# Altium schematic sheet OK6010_DB.SchDoc
size 260 x 195 mm; PageSetup: Record=PageOptions|CenterHorizontal=True|CenterVertical=True|PrintScale=1.06|XCorrection=1.00|YCorrection=1.00|PrintKind=2|BorderSize=5000000|LeftOffset=0|BottomOffset=0|Orientation=2|PaperLength=1000|PaperWidth=1000|Scale=100|PaperSource=15|PrintQuality=600|MediaType=1|DitherType=10|PaperKind=Letter|PrintScaleMode=1
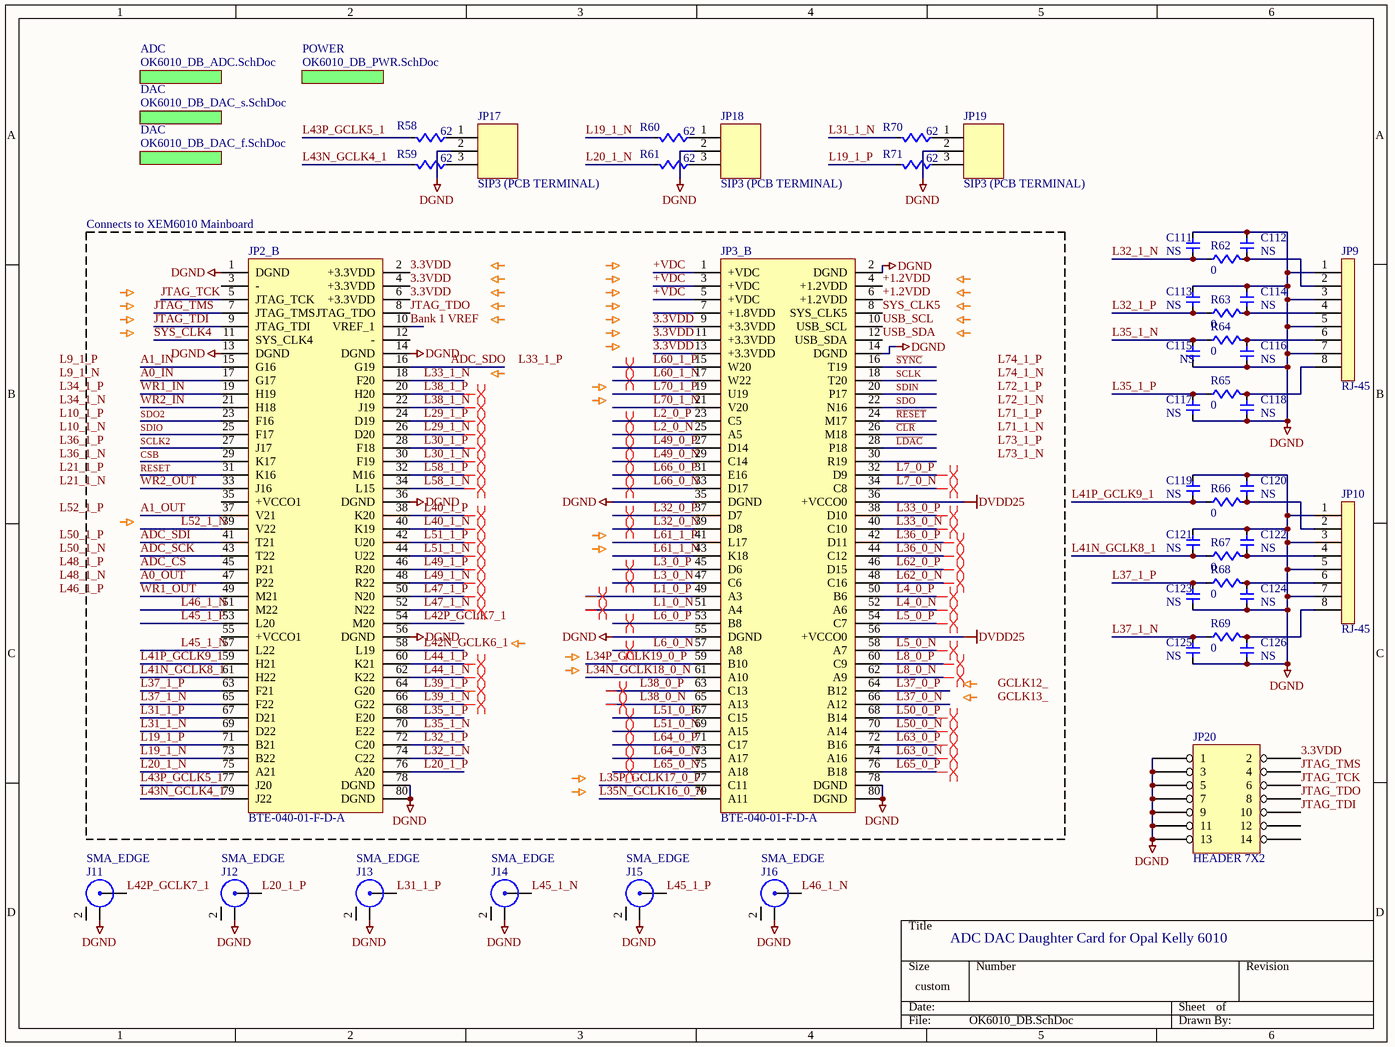
[diagram p0: OK6010_DB.SchDoc]

## Parts
C111  NS  [0603w]
C112  NS  [0603w]
C113  NS  [0603w]
C114  NS  [0603w]
C115  NS  [0603w]
C116  NS  [0603w]
C117  NS  [0603w]
C118  NS  [0603w]
C119  NS  [0603w]
C120  NS  [0603w]
C121  NS  [0603w]
C122  NS  [0603w]
C123  NS  [0603w]
C124  NS  [0603w]
C125  NS  [0603w]
C126  NS  [0603w]
J11  SMA_EDGE  [sma_edge]
J12  SMA_EDGE  [sma_edge]
J13  SMA_EDGE  [sma_edge]
J14  SMA_EDGE  [sma_edge]
J15  SMA_EDGE  [sma_edge]
J16  SMA_EDGE  [sma_edge]
JP2_B  BTE-040-01-F-D-A  [BTE-040-01-F-D-A]
JP3_B  BTE-040-01-F-D-A  [BTE-040-01-F-D-A]
JP9  RJ-45  [SMD_ETHERNET]
JP10  RJ-45  [SMD_ETHERNET]
JP17  SIP3 (PCB TERMINAL)  [SIP3MOLEX]
JP18  SIP3 (PCB TERMINAL)  [SIP3MOLEX]
JP19  SIP3 (PCB TERMINAL)  [SIP3MOLEX]
JP20  HEADER 7X2  [IDC14 SM 2MM]
R58  62  [0603w]
R59  62  [0603w]
R60  62  [0603w]
R61  62  [0603w]
R62  0  [0603w]
R63  0  [0603w]
R64  0  [0603w]
R65  0  [0603w]
R66  0  [0603w]
R67  0  [0603w]
R68  0  [0603w]
R69  0  [0603w]
R70  62  [0603w]
R71  62  [0603w]

## Blocks framed on the sheet
Connects to XEM6010 Mainboard: JP2_B JP3_B

## Sub-sheets
ADC = OK6010_DB_ADC.SchDoc: no entries
DAC = OK6010_DB_DAC_s.SchDoc: no entries
DAC = OK6010_DB_DAC_f.SchDoc: no entries
POWER = OK6010_DB_PWR.SchDoc: no entries

## Nets
DGND: C111.1 C112.1 C113.1 C114.1 C115.2 C116.2 C117.2 C118.2 C119.1 C120.1 C121.1 C122.1 C123.2 C124.2 C125.2 C126.2 J11.2(ground) J12.2(ground) J13.2(ground) J14.2(ground) J15.2(ground) J16.2(ground) JP2_B.1(DGND) JP2_B.13(DGND) JP2_B.14(DGND) JP2_B.36(DGND) JP2_B.56(DGND) JP2_B.78(DGND) JP2_B.80(DGND) JP3_B.2(DGND) JP3_B.14(DGND) JP3_B.35(DGND) JP3_B.55(DGND) JP3_B.78(DGND) JP3_B.80(DGND) JP9.1 JP9.3 JP9.5 JP9.7 JP10.1 JP10.3 JP10.5 JP10.7 JP17.2 JP18.2 JP19.2 JP20.1 JP20.3 JP20.5 JP20.7 JP20.9 JP20.11 JP20.13
DVDD25: JP3_B.36(+VCCO0) JP3_B.56(+VCCO0)
3.3VDD: JP2_B.2(+3.3VDD) JP2_B.4(+3.3VDD) JP2_B.6(+3.3VDD) JP3_B.9(+3.3VDD) JP3_B.11(+3.3VDD) JP3_B.13(+3.3VDD) JP20.2
+1.2VDD: JP3_B.4(+1.2VDD) JP3_B.6(+1.2VDD)
+VDC: JP3_B.1(+VDC) JP3_B.3(+VDC) JP3_B.5(+VDC)
A0_IN: JP2_B.17(G17)
A0_OUT: JP2_B.47(P22)
A1_IN: JP2_B.15(G16)
A1_OUT: JP2_B.37(V21)
ADC_CS: JP2_B.45(P21)
ADC_SCK: JP2_B.43(T22)
ADC_SDI: JP2_B.41(T21)
ADC_SDO: JP2_B.16(G19)
Bank 1 VREF: JP2_B.10(VREF_1)
~{CLR}: JP3_B.26(M18)
CSB: JP2_B.29(K17)
JTAG_TCK: JP2_B.5(JTAG_TCK) JP20.6
JTAG_TDI: JP2_B.9(JTAG_TDI) JP20.10
JTAG_TDO: JP2_B.8(JTAG_TDO) JP20.8
JTAG_TMS: JP2_B.7(JTAG_TMS) JP20.4
L1_0_N: JP3_B.51(A4)
L1_0_P: JP3_B.49(A3)
L2_0_N: JP3_B.25(A5)
L2_0_P: JP3_B.23(C5)
L3_0_N: JP3_B.47(C6)
L3_0_P: JP3_B.45(D6)
L4_0_N: JP3_B.52(A6)
L4_0_P: JP3_B.50(B6)
L5_0_N: JP3_B.58(A7)
L5_0_P: JP3_B.54(C7)
L6_0_N: JP3_B.57(A8)
L6_0_P: JP3_B.53(B8)
L7_0_N: JP3_B.34(C8)
L7_0_P: JP3_B.32(D9)
L8_0_N: JP3_B.62(A9)
L8_0_P: JP3_B.60(C9)
L19_1_N: JP2_B.73(B22) R60.2
L19_1_P: JP2_B.71(B21) R71.2
L20_1_N: JP2_B.75(A21) R61.2
L20_1_P: J12.1(signal) JP2_B.76(A20)
L29_1_N: JP2_B.26(D20)
L29_1_P: JP2_B.24(D19)
L30_1_N: JP2_B.30(F19)
L30_1_P: JP2_B.28(F18)
L31_1_N: JP2_B.69(D22) R70.2
L31_1_P: J13.1(signal) JP2_B.67(D21)
L32_0_N: JP3_B.39(D8)
L32_0_P: JP3_B.37(D7)
L32_1_N: C111.2 JP2_B.74(C22) R62.1
L32_1_P: C113.2 JP2_B.72(C20) R63.1
L33_0_N: JP3_B.40(C10)
L33_0_P: JP3_B.38(D10)
L33_1_N: JP2_B.18(F20)
L34N_GCLK18_0_N: JP3_B.61(A10)
L34P_GCLK19_0_P: JP3_B.59(B10)
L35_1_N: C115.1 JP2_B.70(E22) R64.1
L35_1_P: C117.1 JP2_B.68(E20) R65.1
L35N_GCLK16_0_N: JP3_B.79(A11)
L35P_GCLK17_0_P: JP3_B.77(C11)
L36_0_N: JP3_B.44(C12)
L36_0_P: JP3_B.42(D11)
L37_0_N: JP3_B.66(A12)
L37_0_P: JP3_B.64(B12)
L37_1_N: C125.1 JP2_B.65(F22) R69.1
L37_1_P: C123.1 JP2_B.63(F21) R68.1
L38_0_N: JP3_B.65(A13)
L38_0_P: JP3_B.63(C13)
L38_1_N: JP2_B.22(J19)
L38_1_P: JP2_B.20(H20)
L39_1_N: JP2_B.66(G22)
L39_1_P: JP2_B.64(G20)
L40_1_N: JP2_B.40(K19)
L40_1_P: JP2_B.38(K20)
L41N_GCLK8_1: C121.2 JP2_B.61(H22) R67.1
L41P_GCLK9_1: C119.2 JP2_B.59(H21) R66.1
L42N_GCLK6_1: JP2_B.58(L19)
L42P_GCLK7_1: J11.1(signal) JP2_B.54(M20)
L43N_GCLK4_1: JP2_B.79(J22) R59.2
L43P_GCLK5_1: JP2_B.77(J20) R58.2
L44_1_N: JP2_B.62(K22)
L44_1_P: JP2_B.60(K21)
L45_1_N: J14.1(signal) JP2_B.57(L22)
L45_1_P: J15.1(signal) JP2_B.53(L20)
L46_1_N: J16.1(signal) JP2_B.51(M22)
L47_1_N: JP2_B.52(N22)
L47_1_P: JP2_B.50(N20)
L49_0_N: JP3_B.29(C14)
L49_0_P: JP3_B.27(D14)
L49_1_N: JP2_B.48(R22)
L49_1_P: JP2_B.46(R20)
L50_0_N: JP3_B.70(A14)
L50_0_P: JP3_B.68(B14)
L51_0_N: JP3_B.69(A15)
L51_0_P: JP3_B.67(C15)
L51_1_N: JP2_B.44(U22)
L51_1_P: JP2_B.42(U20)
L52_1_N: JP2_B.39(V22)
L58_1_N: JP2_B.34(L15)
L58_1_P: JP2_B.32(M16)
L60_1_N: JP3_B.17(W22)
L60_1_P: JP3_B.15(W20)
L61_1_N: JP3_B.43(K18)
L61_1_P: JP3_B.41(L17)
L62_0_N: JP3_B.48(C16)
L62_0_P: JP3_B.46(D15)
L63_0_N: JP3_B.74(A16)
L63_0_P: JP3_B.72(B16)
L64_0_N: JP3_B.73(A17)
L64_0_P: JP3_B.71(C17)
L65_0_N: JP3_B.75(A18)
L65_0_P: JP3_B.76(B18)
L66_0_N: JP3_B.33(D17)
L66_0_P: JP3_B.31(E16)
L70_1_N: JP3_B.21(V20)
L70_1_P: JP3_B.19(U19)
~{LDAC}: JP3_B.28(P18)
~{RESET}: JP3_B.24(M17)
RESET: JP2_B.31(K16)
~{SYNC}: JP3_B.16(T19)
SCLK: JP3_B.18(T20)
SCLK2: JP2_B.27(J17)
SDIN: JP3_B.20(P17)
SDIO: JP2_B.25(F17)
SDO: JP3_B.22(N16)
SDO2: JP2_B.23(F16)
SYS_CLK4: JP2_B.11(SYS_CLK4)
SYS_CLK5: JP3_B.8(SYS_CLK5)
USB_SCL: JP3_B.10(USB_SCL)
USB_SDA: JP3_B.12(USB_SDA)
WR1_IN: JP2_B.19(H19)
WR1_OUT: JP2_B.49(M21)
WR2_IN: JP2_B.21(H18)
WR2_OUT: JP2_B.33(J16)
NetC112_2: C112.2 JP9.2 R62.2
NetC114_2: C114.2 JP9.4 R63.2
NetC116_1: C116.1 JP9.6 R64.2
NetC118_1: C118.1 JP9.8 R65.2
NetC120_2: C120.2 JP10.2 R66.2
NetC122_2: C122.2 JP10.4 R67.2
NetC124_1: C124.1 JP10.6 R68.2
NetC126_1: C126.1 JP10.8 R69.2
NetJP17_1: JP17.1 R58.1
NetJP17_3: JP17.3 R59.1
NetJP18_1: JP18.1 R60.1
NetJP18_3: JP18.3 R61.1
NetJP19_1: JP19.1 R70.1
NetJP19_3: JP19.3 R71.1

Not connected (* = marked no-connect by the designer): JP2_B 3(-) 12(-) 35(+VCCO1) 55(+VCCO1); JP3_B 7(+1.8VDD) 30(R19); JP20 12 14

## Layout directives
differential pair: L1_0_N, L1_0_P, L2_0_N, L2_0_P, L3_0_N, L3_0_P, L4_0_N, L4_0_P, L5_0_N, L5_0_P, L6_0_N, L6_0_P, L7_0_N, L7_0_P, L8_0_N, L8_0_P, L29_1_N, L29_1_P, L30_1_N, L30_1_P, L32_0_N, L32_0_P, L33_0_N, L33_0_P, L36_0_N, L36_0_P, L38_0_N, L38_0_P, L38_1_N, L38_1_P, L39_1_N, L39_1_P, L40_1_N, L40_1_P, L44_1_N, L44_1_P, L47_1_N, L47_1_P, L49_0_N, L49_0_P, L49_1_N, L49_1_P, L50_0_N, L50_0_P, L51_0_N, L51_0_P, L51_1_N, L51_1_P, L58_1_N, L58_1_P, L60_1_N, L60_1_P, L62_0_N, L62_0_P, L63_0_N, L63_0_P, L64_0_N, L64_0_P, L65_0_N, L65_0_P, L66_0_N, L66_0_P

## Notes on the sheet
- ADC DAC Daughter Card for Opal Kelly 6010
- Labels drawn without touching a wire or pin: GCLK12_, GCLK13_, L9_1_N, L9_1_P, L10_1_N, L10_1_P, L21_1_N, L21_1_P, L33_1_P, L34_1_N, L34_1_P, L36_1_N, L36_1_P, L46_1_P, L48_1_N, L48_1_P, L50_1_N, L50_1_P, L52_1_P, L71_1_N, L71_1_P, L72_1_N, L72_1_P, L73_1_N, L73_1_P, L74_1_N, L74_1_P

## Library data of the parts
C111-C126 = CAP_SM: capacitor
J11-J16 = SMA_EDGE: sma edge connector; Supplier 1: Digi-Key; Supplier Part Number 1: ACX1426-ND
JP2_B = BTE-040-01-F-D-A XEM6010_JP2: Samtec Connector 0.8mm 80pin; Supplier 1: Newark; Supplier Part Number 1: 89M7080
JP3_B = BTE-040-01-F-D-A XEM6010_JP3: Samtec Connector 0.8mm 80pin; Supplier 1: Newark; Supplier Part Number 1: 89M7080
JP9 JP10 = SIP8: ethernet connector; Supplier 1: Digi-Key; Supplier Part Number 1: RJSSE-5080-ND
JP17-JP19 = SIP3 (PCB TERMINAL): 3 pin molex connector; Supplier 1: Digi-Key; Supplier Part Number 1: WM2745-ND
JP20 = HEADER 7X2: 14 pin 2mm IDC connector; Supplier 1: Digi-Key; Supplier Part Number 1: WM18641-ND
R58-R71 = RES_SM: resistor; Supplier 1: Digi-Key
  R58-R61 R70 R71: Supplier Part Number 1: 541-62.0HCT-ND
  R62-R69: Supplier Part Number 1: P0.0GCT-ND